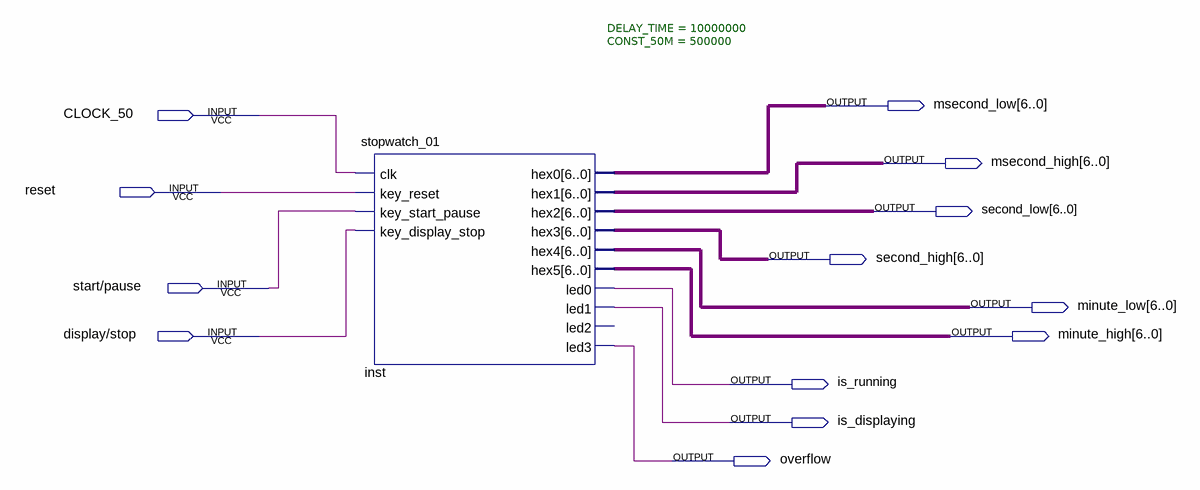
[diagram p0: schematic sheet]
// Quartus schematic lab1_timer.bdf as structural Verilog: 1 symbols, 13 pins
module lab1_timer (
  input  CLOCK_50,
  input  reset,
  input  \start/pause ,
  input  \display/stop ,
  output [6:0] msecond_low,
  output [6:0] msecond_high,
  output [6:0] second_low,
  output [6:0] second_high,
  output [6:0] minute_low,
  output [6:0] minute_high,
  output is_running,
  output is_displaying,
  output overflow
);

  stopwatch_01 #(.DELAY_TIME(10000000), .CONST_50M(500000)) inst (
    .clk(CLOCK_50), .key_reset(reset), .key_start_pause(\start/pause ), .key_display_stop(\display/stop ),
    .hex0(msecond_low), .hex1(msecond_high), .hex2(second_low), .hex3(second_high), .hex4(minute_low),
    .hex5(minute_high), .led0(is_running), .led1(is_displaying), .led3(overflow));  // open: led2
endmodule
